# Altium schematic sheet BSU_RTD.SchDoc: RTD
size A4; Organization: PERT; SheetNumber: 8; SheetTotal: 8; Sub Team: EEE
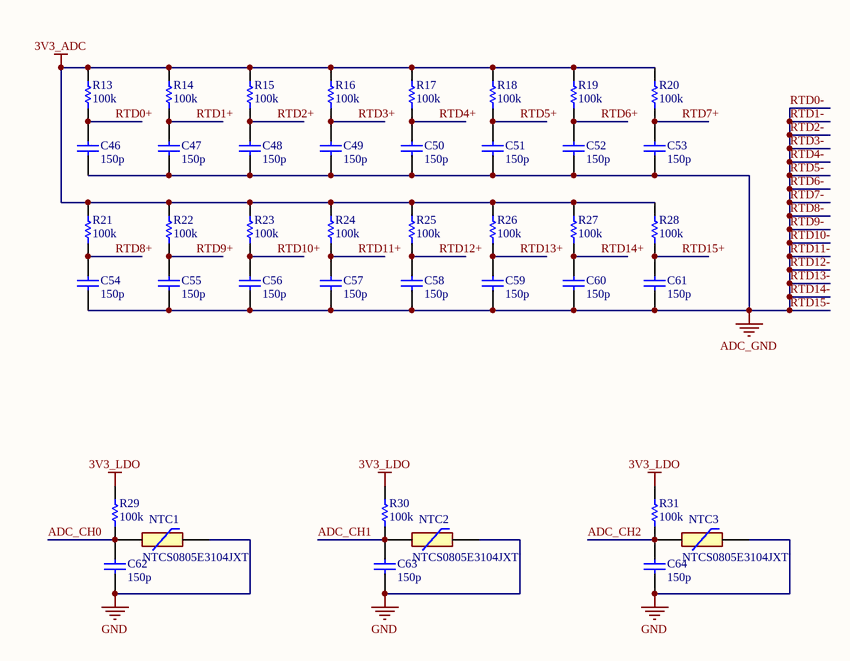
[diagram p0: BSU_RTD.SchDoc]

## Parts
C46  150p  [0603_SMD_C]
C47  150p  [0603_SMD_C]
C48  150p  [0603_SMD_C]
C49  150p  [0603_SMD_C]
C50  150p  [0603_SMD_C]
C51  150p  [0603_SMD_C]
C52  150p  [0603_SMD_C]
C53  150p  [0603_SMD_C]
C54  150p  [0603_SMD_C]
C55  150p  [0603_SMD_C]
C56  150p  [0603_SMD_C]
C57  150p  [0603_SMD_C]
C58  150p  [0603_SMD_C]
C59  150p  [0603_SMD_C]
C60  150p  [0603_SMD_C]
C61  150p  [0603_SMD_C]
C62  150p  [0805_SMD_C]
C63  150p  [0805_SMD_C]
C64  150p  [0805_SMD_C]
NTC1  NTCS0805E3104JXT  [0805_SMD_R]
NTC2  NTCS0805E3104JXT  [0805_SMD_R]
NTC3  NTCS0805E3104JXT  [0805_SMD_R]
R13  100k  [0603_SMD_R]
R14  100k  [0603_SMD_R]
R15  100k  [0603_SMD_R]
R16  100k  [0603_SMD_R]
R17  100k  [0603_SMD_R]
R18  100k  [0603_SMD_R]
R19  100k  [0603_SMD_R]
R20  100k  [0603_SMD_R]
R21  100k  [0603_SMD_R]
R22  100k  [0603_SMD_R]
R23  100k  [0603_SMD_R]
R24  100k  [0603_SMD_R]
R25  100k  [0603_SMD_R]
R26  100k  [0603_SMD_R]
R27  100k  [0603_SMD_R]
R28  100k  [0603_SMD_R]
R29  100k  [0805_SMD_R]
R30  100k  [0805_SMD_R]
R31  100k  [0805_SMD_R]

## Nets
3V3_ADC: R13.2 R14.2 R15.2 R16.2 R17.2 R18.2 R19.2 R20.2 R21.2 R22.2 R23.2 R24.2 R25.2 R26.2 R27.2 R28.2
3V3_LDO: R29.2 R30.2 R31.2
GND: C62.1 C63.1 C64.1 NTC1.1 NTC2.1 NTC3.1
RTD0-: C46.1 C47.1 C48.1 C49.1 C50.1 C51.1 C52.1 C53.1 C54.1 C55.1 C56.1 C57.1 C58.1 C59.1 C60.1 C61.1  [also labelled ADC_GND, RTD1-, RTD10-, RTD11-, RTD12-, RTD13-, RTD14-, RTD15-, RTD2-, RTD3-, RTD4-, RTD5-, RTD6-, RTD7-, RTD8-, RTD9-]
ADC_CH0: C62.2 NTC1.2 R29.1
ADC_CH1: C63.2 NTC2.2 R30.1
ADC_CH2: C64.2 NTC3.2 R31.1
RTD0+: C46.2 R13.1
RTD1+: C47.2 R14.1
RTD2+: C48.2 R15.1
RTD3+: C49.2 R16.1
RTD4+: C50.2 R17.1
RTD5+: C51.2 R18.1
RTD6+: C52.2 R19.1
RTD7+: C53.2 R20.1
RTD8+: C54.2 R21.1
RTD9+: C55.2 R22.1
RTD10+: C56.2 R23.1
RTD11+: C57.2 R24.1
RTD12+: C58.2 R25.1
RTD13+: C59.2 R26.1
RTD14+: C60.2 R27.1
RTD15+: C61.2 R28.1

## Notes on the sheet
- Title
- Generation
- Organization
- Sub Team
- Module
- Ver.
- Rev.
- Date
- Draw By

## Library data of the parts
C46-C61 = 0603_SMD_Capacitor: 0603 SMD Capacitor; Voltage Rating: *; Tolerance: *; Dielectric: *; Value: 150p
C62-C64 = 0805_SMD_Capacitor: 0805 SMD Capacitor; Voltage Rating: *; Tolerance: *; Dielectric: *; Value: 150p
NTC1-NTC3 = 0805_SMD_NTC_Thermistor_100k: NTC Thermistors 100Kohms 5% SMD; Manufacturer_Name: Vishay; Geometry.Height: 0.95mm; Mouser Part Number: 594-NTCS0805E3104JXT; Mouser Price/Stock: https://www.mouser.co.uk/ProductDetail/Vishay-BC-Components/NTCS0805E3104JXT?qs=Y0gyZw6qHXedwsSst0X8tA%3D%3D; Manufacturer_Part_Number: NTCS0805E3104JXT; Datasheet Link: http://www.vishay.com/docs/29044/ntcs0805e3t.pdf
R13-R28 = 0603_SMD_Resistor: 0603 SMD Resistor; Tolerance: *; Power Rating: *; Temperature Coefficient: *; Value: 100k
R29-R31 = 0805_SMD_Resistor: 0805 SMD Resistor; Tolerance: *; Power Rating: *; Temperature Coefficient: *; Value: 100k